# EAGLE design temp_sensors_array_A (EAGLE 7.5.0)
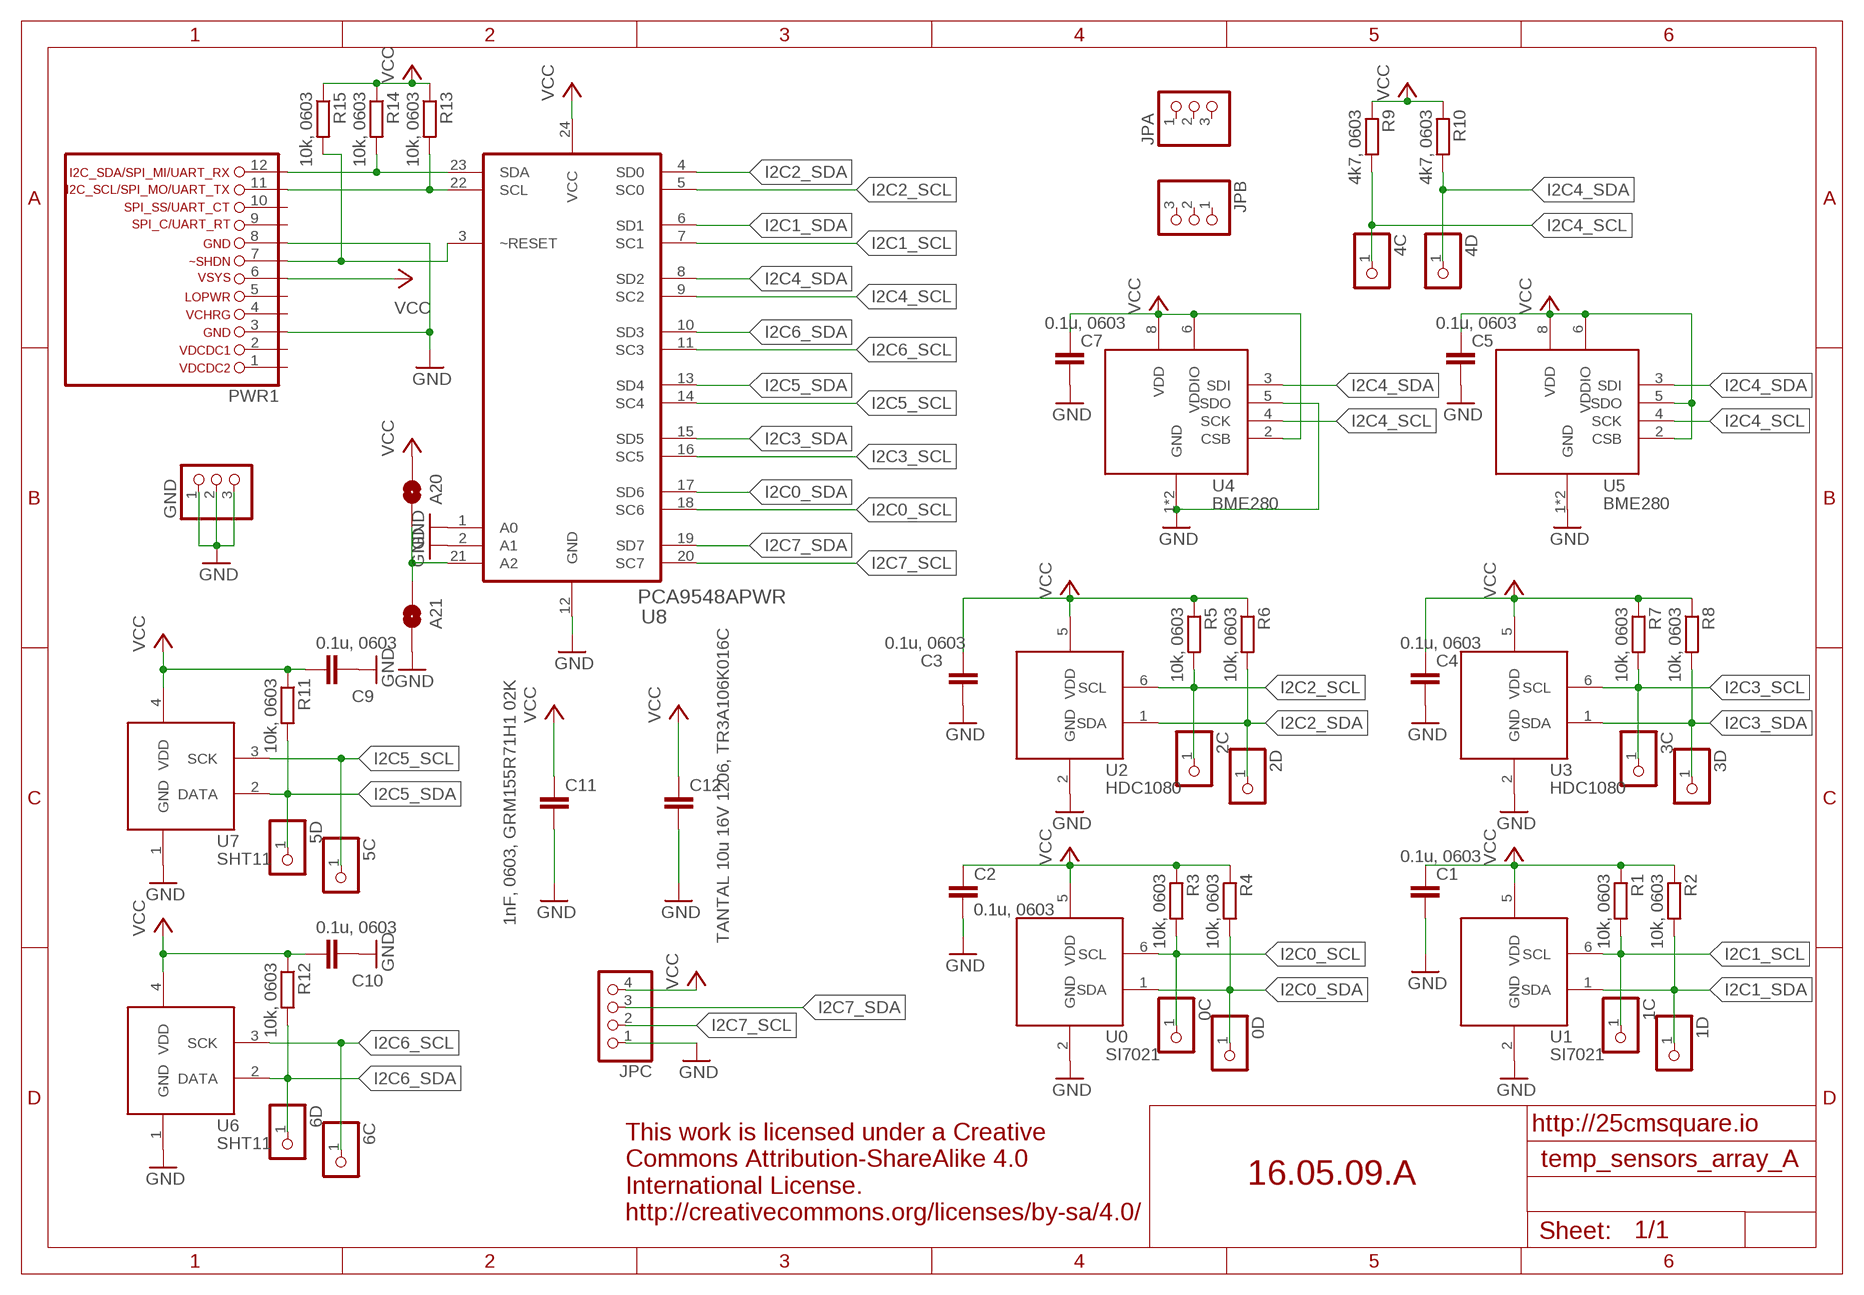
[diagram p0: schematic, sheet 1]

## Parts
0C  PINHD-1X1  [1X01]
0D  PINHD-1X1  [1X01]
1C  PINHD-1X1  [1X01]
1D  PINHD-1X1  [1X01]
2C  PINHD-1X1  [1X01]
2D  PINHD-1X1  [1X01]
3C  PINHD-1X1  [1X01]
3D  PINHD-1X1  [1X01]
4C  PINHD-1X1  [1X01]
4D  PINHD-1X1  [1X01]
5C  PINHD-1X1  [1X01]
5D  PINHD-1X1  [1X01]
6C  PINHD-1X1  [1X01]
6D  PINHD-1X1  [1X01]
A20  SOLDERJUMPERNO  [SJ_2S-NO]
A21  SOLDERJUMPERNO  [SJ_2S-NO]
C1  0.1u, 0603  C-EUC0603K  [C0603K]
C2  0.1u, 0603  C-EUC0603K  [C0603K]
C3  0.1u, 0603  C-EUC0603K  [C0603K]
C4  0.1u, 0603  C-EUC0603K  [C0603K]
C5  0.1u, 0603  C-EUC0603K  [C0603K]
C7  0.1u, 0603  C-EUC0603K  [C0603K]
C9  0.1u, 0603  C-EUC0603K  [C0603K]
C10  0.1u, 0603  C-EUC0603K  [C0603K]
C11  1nF, 0603, GRM155R71H1 02K  C-EUC0603K  [C0603K]
C12  TANTAL 10u 16V 1206, TR3A106K016C  C-EUC1206K  [C1206K]
GND  PINHD-1X3  [1X03]
JPA  PINHD-1X3  [1X03]
JPB  PINHD-1X3  [1X03]
JPC  PINHD-1X4  [1X04]
PWR1  LIWE_12_PIN_PWR  [LIWE_12_PIN]
R1  10k, 0603  R-EU_R0603  [R0603]
R2  10k, 0603  R-EU_R0603  [R0603]
R3  10k, 0603  R-EU_R0603  [R0603]
R4  10k, 0603  R-EU_R0603  [R0603]
R5  10k, 0603  R-EU_R0603  [R0603]
R6  10k, 0603  R-EU_R0603  [R0603]
R7  10k, 0603  R-EU_R0603  [R0603]
R8  10k, 0603  R-EU_R0603  [R0603]
R9  4k7, 0603  R-EU_R0603  [R0603]
R10  4k7, 0603  R-EU_R0603  [R0603]
R11  10k, 0603  R-EU_R0603  [R0603]
R12  10k, 0603  R-EU_R0603  [R0603]
R13  10k, 0603  R-EU_R0603  [R0603]
R14  10k, 0603  R-EU_R0603  [R0603]
R15  10k, 0603  R-EU_R0603  [R0603]
U0  SI7021  [SI7021]
U1  SI7021  [SI7021]
U2  HDC1080  [SI7021]
U3  HDC1080  [SI7021]
U4  BME280  [BME1080]
U5  BME280  [BME1080]
U6  SHT11  [SHT1X]
U7  SHT11  [SHT1X]
U8  PCA9548APWR  [SOP65P640X120-24N]

## Nets
GND: A21.2 C1.2 C2.2 C3.2 C4.2 C5.2 C7.2 C9.2 C10.2 C11.2 C12.2 GND.1 GND.2 GND.3 JPC.1 PWR1.3 PWR1.8 U0.2(GND) U1.2(GND) U2.2(GND) U3.2(GND) U4.1(GND) U4.5(SDO) U4.7(GND) U5.1(GND) U5.7(GND) U6.1(GND) U7.1(GND) U8.1(A0) U8.2(A1) U8.12(GND)
I2C0_SCL: 0C.1 R3.2 U0.6(SCL) U8.18(SC6)
I2C0_SDA: 0D.1 R4.2 U0.1(SDA) U8.17(SD6)
I2C1_SCL: 1C.1 R1.2 U1.6(SCL) U8.7(SC1)
I2C1_SDA: 1D.1 R2.2 U1.1(SDA) U8.6(SD1)
I2C2_SCL: 2C.1 R5.2 U2.6(SCL) U8.5(SC0)
I2C2_SDA: 2D.1 R6.2 U2.1(SDA) U8.4(SD0)
I2C3_SCL: 3C.1 R7.2 U3.6(SCL) U8.16(SC5)
I2C3_SDA: 3D.1 R8.2 U3.1(SDA) U8.15(SD5)
I2C4_SCL: 4C.1 R9.2 U4.4(SCK) U5.4(SCK) U8.9(SC2)
I2C4_SDA: 4D.1 R10.2 U4.3(SDI) U5.3(SDI) U8.8(SD2)
I2C5_SCL: 5C.1 U7.3(SCK) U8.14(SC4)
I2C5_SDA: 5D.1 R11.2 U7.2(DATA) U8.13(SD4)
I2C6_SCL: 6C.1 U6.3(SCK) U8.11(SC3)
I2C6_SDA: 6D.1 R12.2 U6.2(DATA) U8.10(SD3)
I2C7_SCL: JPC.2 U8.20(SC7)
I2C7_SDA: JPC.3 U8.19(SD7)
N$1: A20.2 A21.1 U8.21(A2)
NRESET: PWR1.7 R15.2 U8.3(~RESET)
SCL: PWR1.11 R13.2 U8.22(SCL)
SDA: PWR1.12 R14.2 U8.23(SDA)
VCC: A20.1 C1.1 C2.1 C3.1 C4.1 C5.1 C7.1 C9.1 C10.1 C11.1 C12.1 JPC.4 PWR1.6 R1.1 R2.1 R3.1 R4.1 R5.1 R6.1 R7.1 R8.1 R9.1 R10.1 R11.1 R12.1 R13.1 R14.1 R15.1 U0.5(VDD) U1.5(VDD) U2.5(VDD) U3.5(VDD) U4.2(CSB) U4.6(VDDIO) U4.8(VDD) U5.2(CSB) U5.5(SDO) U5.6(VDDIO) U5.8(VDD) U6.4(VDD) U7.4(VDD) U8.24(VCC)
Unconnected: JPA.1 JPA.2 JPA.3 JPB.1 JPB.2 JPB.3 PWR1.1 PWR1.2 PWR1.4 PWR1.5 PWR1.9 PWR1.10

## Notes on the sheet
- http://25cmsquare.io
- 16.05.09.A
- This work is licensed under a Creative
  Commons Attribution-ShareAlike 4.0
  International License.
  http://creativecommons.org/licenses/by-sa/4.0/

## Library data of the parts
0C 0D 1C 1D 2C 2D 3C 3D 4C 4D 5C 5D 6C 6D = pinhead:PINHD-1X1: PIN HEADER
A20 A21 = SparkFun-Passives:SOLDERJUMPER: Solder Jumper Standard SMD solder jumper. Used to automate production. Two varients : Normally Open and Normally Closed are the same, but have different paste layers. NC will have a large amount of paste and should jumper during reflow.
C1-C5 C7 C9-C11 = rcl:C-EU: CAPACITOR, European symbol
C12 = resistor:C-EU: CAPACITOR, European symbol; SPICEPREFIX: C
GND JPA JPB = pinhead:PINHD-1X3: PIN HEADER
JPC = pinhead:PINHD-1X4: PIN HEADER
PWR1 = 25cmsquare:LIWE_12_PIN_PWR
R1-R15 = rcl:R-EU_: RESISTOR, European symbol
U0 U1 = 25cmsquare:SI7021: SI7021 https://www.silabs.com/Support%20Documents/TechnicalDocs/Si7021-A20.pdf
U2 U3 = 25cmsquare:HDC1080: HDC1080 http://www.ti.com.cn/cn/lit/ds/symlink/hdc1080.pdf
U4 U5 = 25cmsquare:BME280
U6 U7 = 25cmsquare:SHT11: SHT11 https://www.sensirion.com/fileadmin/user_upload/customers/sensirion/Dokumente/Humidity_Sensors/Sensirion_Humidity_Sensors_SHT1x_Datasheet_V5.pdf
U8 = Texas Instruments_By_element14_Batch_1:PCA9548APWR: 8-CHANNEL I2C SWITCH WITH RESET; MPN: PCA9548APWR False; OC_FARNELL: 1607855; OC_NEWARK: 22M1602; PACKAGE: TSSOP-24; SUPPLIER: Texas Instruments

## Board
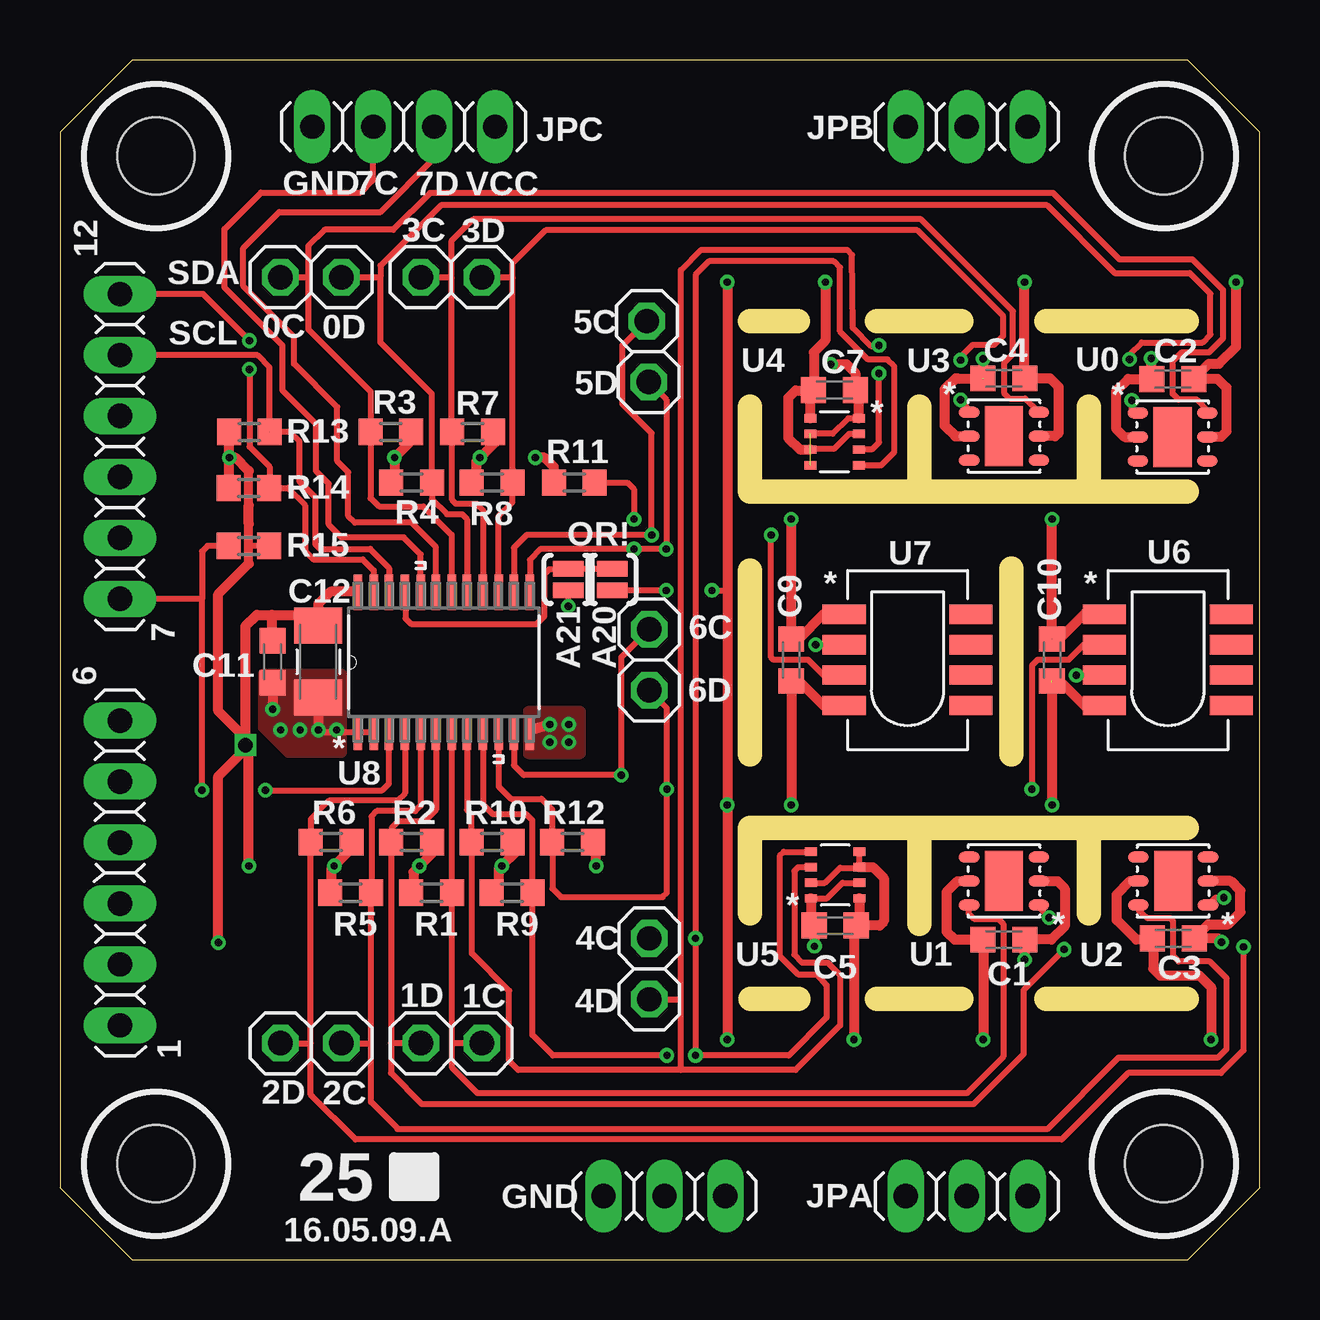
[diagram p1: board, top side]
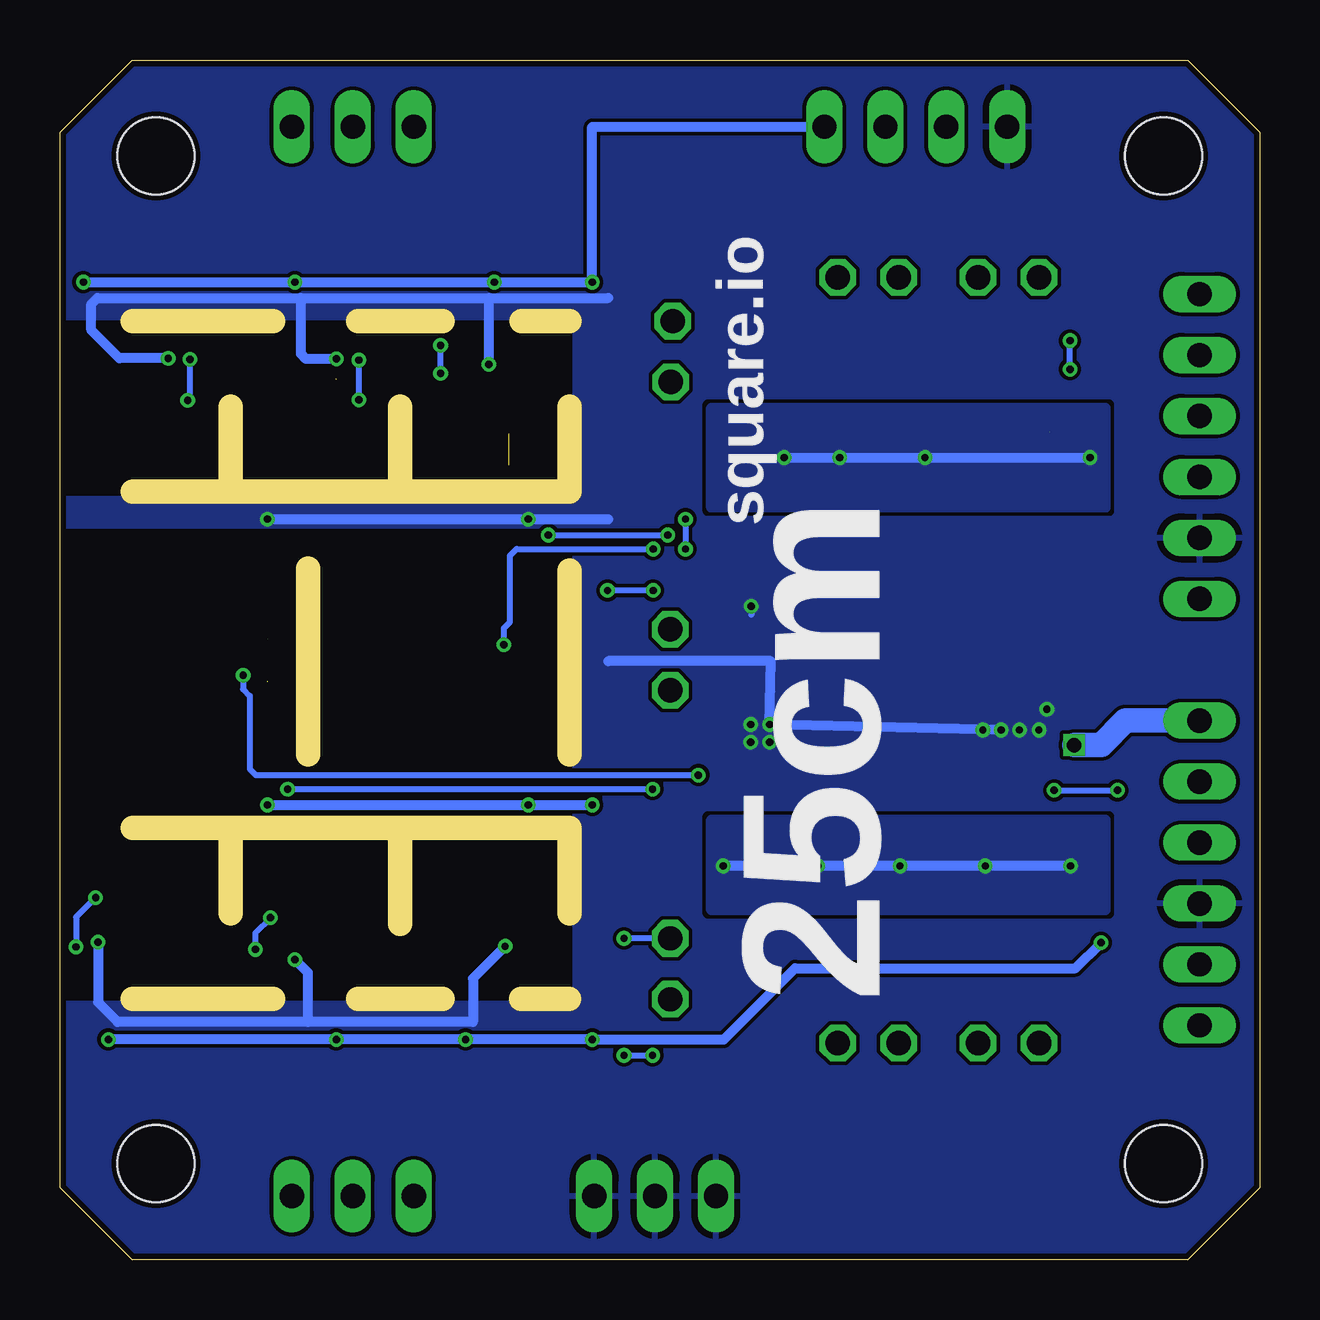
[diagram p2: board, bottom side, seen from below]

Size 50 x 50 mm. Coordinates in mm from the lower left corner, seen from the top.
Copper layers (1*16): Top 0.035mm / dielectric 1.5mm / Bottom 0.035mm
Design rules "SeeedStudio_2layer_DRU_no_angle_20140221": minimum track width 6mil, minimum drill 12mil, track to track 6mil, track to pad 6mil, pad to pad 6mil, via to via 6mil, smd to smd 0mil, copper to edge 10mil, drill to drill 10mil, minimum pad ring 10mil, minimum via ring 6mil, stop-mask expansion 2mil, vias tented up to drill 100mil, thermal gap 10mil
bRestrict: area 28.8,32 to 51.1,39; area 28.8,18 to 51.3,30.4; area 28.8,10.9 to 51.6,17.8
Milling: 20 lines

### Footprints (pad centres in the part's own frame; a part is rotated, then mirrored left to right if it is on the bottom)
1X01 = drill 1.016 octagon: 1 0,0
SJ_2S-NO = smd 0.635 x 1.27: 1 -0.45,0; 2 0.45,0
C0603K = smd 1.05 x 1.08: 1 -0.875,0; 2 0.875,0
C1206K = smd 1.5 x 2: 1 -1.5,0; 2 1.5,0
1X03 = drill 1.016 long: 1 -2.54,0; 2 0,0; 3 2.54,0
1X04 = drill 1.016 long: 1 -3.81,0; 2 -1.27,0; 3 1.27,0; 4 3.81,0
LIWE_12_PIN = drill 1.016 long: 1 22.5,15.24; 2 22.5,12.7; 3 22.5,10.16; 4 22.5,7.62; 5 22.5,5.08; 6 22.5,2.54; 7 22.5,-2.54; 8 22.5,-5.08; 9 22.5,-7.62; 10 22.5,-10.16; 11 22.5,-12.7; 12 22.5,-15.24 | hole 3.2: -21,-21; 21,-21; -21,21; 21,21
R0603 = smd 1 x 1.1: 1 -0.85,0; 2 0.85,0
SI7021 = smd 0.85 x 0.45: 1 -1.45,1; 2 -1.45,0; 3 -1.45,-1; 4 1.45,-1; 5 1.45,0; 6 1.45,1 | smd 1.6 x 2.5: P$7 0,0
BME1080 = smd 0.5 x 0.35: 1 1.012,0.975; 2 1.012,0.325; 3 1.012,-0.325; 4 1.012,-0.975; 5 -1.012,-0.975; 6 -1.012,-0.325; 7 -1.012,0.325; 8 -1.012,0.975
SHT1X = smd 1.8 x 0.8: 1 -2.64,1.905; 2 -2.64,0.635; 3 -2.64,-0.635; 4 -2.64,-1.905; 5 2.64,-1.905; 6 2.64,-0.635; 7 2.64,0.635; 8 2.64,1.905
SOP65P640X120-24N = smd 1.473 x 0.356: 1 -2.921,3.581; 2 -2.921,2.921; 3 -2.921,2.286; 4 -2.921,1.626; 5 -2.921,0.965; 6 -2.921,0.33; 7 -2.921,-0.33; 8 -2.921,-0.965; 9 -2.921,-1.626; 10 -2.921,-2.286; 11 -2.921,-2.921; 12 -2.921,-3.581; 13 2.921,-3.581; 14 2.921,-2.921; 15 2.921,-2.286; 16 2.921,-1.626; 17 2.921,-0.965; 18 2.921,-0.33; 19 2.921,0.33; 20 2.921,0.965; 21 2.921,1.626; 22 2.921,2.286; 23 2.921,2.921; 24 2.921,3.581

### Placement (x,y rotation side)
0C  9.19,40.94 0 top
0D  11.73,40.94 0 top
1C  17.58,9.02 0 top
1D  15.04,9.02 0 top
2C  11.73,9.02 0 top
2D  9.19,9.02 0 top
3C  15.04,40.94 0 top
3D  17.58,40.94 0 top
4C  24.56,13.39 0 top
4D  24.56,10.85 0 top
5C  24.46,39.12 0 top
5D  24.54,36.58 0 top
6C  24.56,26.26 0 top
6D  24.56,23.72 0 top
A20  23.01,28.35 90 top
A21  21.18,28.35 270 top
C1  39.34,13.34 0 top
C2  46.38,36.7 180 top
C3  46.41,13.39 0 top
C4  39.34,36.73 180 top
C5  32.31,13.92 180 top
C7  32.28,36.25 0 top
C9  30.48,24.99 90 top
C10  41.35,24.99 90 top
C11  8.86,24.92 270 top
C12  10.77,24.92 270 top
GND  25.2,2.64 0 top
JPA  37.8,2.64 0 top
JPB  37.8,47.22 0 top
JPC  14.33,47.22 0 top
PWR1  25,25 180 top
R1  15.49,15.29 0 top
R2  14.66,17.4 180 top
R3  13.79,34.49 180 top
R4  14.66,32.38 0 top
R5  12.12,15.29 0 top
R6  11.3,17.4 180 top
R7  17.2,34.49 180 top
R8  18.01,32.38 0 top
R9  18.85,15.29 0 top
R10  18.01,17.4 180 top
R11  21.44,32.38 0 top
R12  21.36,17.4 180 top
R13  7.9,34.49 0 top
R14  7.87,32.15 0 top
R15  7.87,29.74 180 top
U0  46.38,34.29 0 top
U1  39.34,15.77 180 top
U2  46.41,15.77 180 top
U3  39.34,34.32 0 top
U4  32.28,34.09 0 top
U5  32.31,16.03 180 top
U6  46.18,24.99 0 top
U7  35.33,24.99 0 top
U8  16,24.89 90 top

### Tracks (layer width: path | path; a pad name or v marks a point on that pad's centre or on a via)
GND  (via drill 0.3)  (4 unrouted)
  Top 0.254: 33.17,36.13 C7.2 | U4.1 32.85,35.06 32.21,34.42 U4.7 | 37.31,36.73 37.41,36.73 37.44,36.7 | U5.1 31.31,15.06 31.98,15.06 32.62,15.7 U5.7 | A21.2 v21.18,27.23 | U8.2 U8.1 10.87,21.97 v10.77,22.07
  Top 0.406: v30.48,30.86 C9.2 30.82,25.89 31.85,26.92 U7.1 | v41.35,30.86 41.35,25.86 41.71,25.91 42.75,26.95 U6.1 | 38.47,36.6 C4.2 37.41,36.73 37.34,36.73 36.88,36.27 36.88,34.75 37.31,34.31 U3.2 | 47.14,13.2 C3.2 | 47.88,15.75 U2.2 48.79,15.77 49.2,15.37 49.2,14.48 48.69,13.97 47.87,13.97 C3.2 | U5.1 31.3,14.06 C5.2 31.42,13.9 31.45,13.88 v31.45,13.06 | C11.2 v8.87,22.94 | C12.2 v10.77,22.07 | U0.2 44.37,34.29 44.02,34.65 44.02,36.2 44.53,36.7 C2.2 v45.49,37.57 | 38.48,36.7 v38.48,37.54 | U4.1 33.3,36.25 C7.2 33.15,36.26 33.15,36.96 32.79,37.31 v32.13,37.31 | v48.41,13.23 48.26,13.39 C3.2 | U1.2 41.58,15.77 41.88,15.47 41.88,13.89 41.33,13.34 C1.2 40.21,13.32 v40.21,12.5 | v20.42,22.3 19.68,22.07 arc90 U8.12
  Bottom 0.254: v21.18,27.23 21.18,26.87
  Bottom 0.406: 39.95,40.08 48.44,40.08 48.69,39.83 48.69,38.73 47.52,37.57 v45.49,37.57 | 39.95,40.08 32.13,40.08 | 32.13,40.08 27.15,40.08 | 39.67,9.91 32.79,9.91 32.79,11.71 v31.45,13.06 | 39.67,9.91 47.6,9.91 48.41,10.72 v48.41,13.23 | 27.15,30.86 v30.48,30.86 v41.35,30.86 | v10.77,22.07 v20.42,22.3 20.37,24.94 27.15,24.94 | v38.48,37.54 39.75,37.54 39.95,37.74 39.95,40.08 | 32.13,40.08 v32.13,37.31 | v40.21,12.5 39.67,11.96 39.67,9.91
  other vias: 10.01,22.07 11.53,22.07 9.19,22.07 21.21,22.3 21.21,21.56 20.42,21.56
  pour Bottom (rank 2): -2.24,50.93 -2.24,-1.78 52.15,-1.78 52.15,50.93
  pour Top (no thermals): 8.46,24.41 8.46,22.17 9.5,21.13 11.76,21.13 11.76,23.88 11.76,24.41
  pour Top (no thermals): 19.51,22.86 19.51,21.08 21.72,21.08 21.72,22.86
I2C0_SCL
  Top 0.254: U8.18 16.33,30.2 15.14,31.39 13.31,31.39 12.94,31.74 R3.2 12.95,34.51 12.95,36.17 10.35,38.77 10.35,40.97 | U0.6 47.83,35.41 47.4,35.84 46.63,35.84 46.38,36.09 46.38,37.44 46.76,37.82 47.9,37.82 48.49,38.41 48.49,40.41 47.22,41.68 44.17,41.68 41.4,44.45 15.42,44.45 13.89,42.93 11.02,42.93 10.35,42.25 10.35,40.97 | 0C.1 10.33,40.95 10.35,40.97
I2C0_SDA  (via drill 0.3)
  Top 0.254: U8.17 16.97,30.86 16.76,31.06 16.13,31.06 15.51,31.69 R4.2 15.49,32.46 15.49,36.09 13.36,38.23 13.36,40.97 | U0.1 44.68,35.41 v44.68,35.81 | 44.58,37.57 v44.58,37.52 44.58,37.72 45.09,38.23 47.62,38.23 47.95,38.56 47.95,40.26 47.09,41.12 43.97,41.12 41.15,43.94 15.88,43.94 13.36,41.43 13.36,40.97 | 0D.1 13.34,40.95 13.36,40.97
  Bottom 0.254: v44.68,35.81 44.58,35.99 v44.58,37.52
I2C1_SCL
  Top 0.254: U1.6 37.9,14.4 38.1,14.2 39.12,14.2 39.32,13.99 39.32,8.46 37.8,6.93 17.4,6.93 16.34,7.99 16.34,9.02 | U8.7 16.33,15.3 arc90 R1.2 16.34,9.02 | 1C.1 16.34,9.02
I2C1_SDA  (via drill 0.3)
  Top 0.254: U8.6 15.67,18.75 15.19,18.26 14.1,18.26 13.84,18.01 13.84,17.49 R2.2 13.79,17.34 13.79,9.02 | v41.22,14.25 40.8,14.68 U1.1 | v41.86,12.93 40.16,11.23 40.16,8.56 38.08,6.48 15.09,6.48 13.79,7.77 13.79,9.02 | 1D.1 13.79,9.02
  Bottom 0.254: v41.22,14.25 41.86,13.61 v41.86,12.93
I2C2_SCL
  Top 0.254: U8.5 15.04,18.92 14.81,18.69 13.21,18.69 12.98,18.47 12.98,15.49 R5.2 12.97,9.02 | 12.97,9.02 12.97,6.57 14.07,5.46 14.07,5.44 41.15,5.44 44.12,8.41 48.26,8.41 48.62,8.76 48.62,11.73 47.93,12.42 46.63,12.42 46.41,12.65 46.41,14.1 46.3,14.22 45.34,14.22 44.96,14.58 U2.6 | 2C.1 12.97,9.02
I2C2_SDA  (via drill 0.3)
  Top 0.254: v49.33,13.03 49.33,8.71 48.39,7.77 44.53,7.77 41.76,5 12.32,5 10.45,6.87 10.45,9.02 | U8.4 14.38,19.43 14.07,19.13 11.23,19.13 10.45,18.35 R6.2 10.45,9.02 | U2.1 48.17,15.09 v48.51,15.09 | 2D.1 10.45,9.02
  Bottom 0.254: v48.51,15.09 49.33,14.28 v49.33,13.03
I2C3_SCL
  Top 0.254: U8.16 17.65,27.84 17.65,31.22 17.37,31.5 16.51,31.5 16.35,31.66 R7.2 16.33,34.69 16.33,40.92 | 16.33,40.92 16.33,42.47 17.22,43.36 35.89,43.36 39.73,39.52 39.73,37.74 39.34,37.36 39.34,36.12 39.57,35.89 40.22,35.89 U3.6 | 3C.1 16.31,40.95 16.33,40.92
I2C3_SDA  (via drill 0.3)
  Top 0.254: 37.92,35.34 U3.1 37.9,35.41 v37.54,35.84 | U8.15 18.29,30.99 18.86,31.56 R8.2 18.87,32.93 18.87,40.92 | 18.87,40.92 18.87,41.53 20.24,42.9 35.74,42.9 39.32,39.32 39.32,38.51 38.94,38.12 38.05,38.12 37.54,37.62 v37.54,37.49 | 3D.1 18.85,40.95 18.87,40.92
  Bottom 0.254: v37.54,35.84 v37.54,37.49
I2C4_SCL  (via drill 0.3)
  Top 0.254: U8.9 17.63,18.97 18.03,18.57 19.43,18.57 19.68,18.31 19.68,15.4 R9.2 19.7,9.36 20.55,8.51 v25.3,8.51 | U4.4 34.23,33.11 34.77,33.66 34.77,37.24 34.49,37.52 33.68,37.52 32.51,38.68 32.51,41.35 32.26,41.6 27.05,41.6 26.49,41.05 v26.49,13.39 v26.49,8.51 30.38,8.51 31.95,10.08 31.95,11.43 31.55,11.89 30.76,11.89 30,12.65 30,16.82 30.18,16.99 31.29,16.99 U5.4
  Bottom 0.254: v26.49,8.51 v25.3,8.51 | 4C.1 v26.49,13.39
I2C4_SDA  (via drill 0.3 pad 0.3)
  Top 0.254: U5.3 30.77,16.35 30.61,16.2 30.61,12.7 30.94,12.37 32,12.37 32.51,11.86 32.51,9.75 30.66,7.9 25.88,7.9 | 25.88,7.9 25.88,10.85 | 25.88,10.85 25.88,41.25 26.72,42.09 32.82,42.09 33.02,41.88 33.05,38.84 33.81,38.08 34.11,38.08 v34.14,38.1 | U8.8 16.97,18.75 17.14,18.57 17.14,17.51 R10.2 17.17,16.84 17.17,12.75 18.72,11.2 18.72,8.28 19.1,7.9 25.88,7.9 | v34.14,36.93 34.14,34.06 33.84,33.76 U4.3 | 4D.1 25.88,10.85
  Bottom 0.254: v34.14,36.93 v34.14,38.1
I2C5_SCL  (via drill 0.3)
  Top 0.254: U8.14 18.92,29.67 19.46,30.2 v24.66,30.2 24.66,34.44 23.44,35.66 23.44,38.1 5C.1 | U7.3 31.83,24.36 31.19,24.99 29.74,24.99 29.64,25.09 v29.64,30.2
  Bottom 0.254: v29.64,30.2 v24.66,30.2
I2C5_SDA  (via drill 0.3)
  Top 0.254: U7.2 v31.5,25.63 | U8.13 19.58,29.16 20.04,29.62 23.42,29.62 v23.93,29.62 v25.27,29.62 25.27,35.84 5D.1 | R11.2 23.65,32.38 23.93,32.11 v23.93,30.86
  Bottom 0.254: v25.27,29.62 30.96,29.62 31.24,29.34 31.24,26.57 31.5,26.31 v31.5,25.63 | v23.93,30.86 v23.93,29.62
I2C6_SCL  (via drill 0.3)
  Top 0.254: U8.11 18.92,20.6 19.33,20.19 v23.39,20.19 23.39,25.09 6C.1 | U6.3 v42.37,24.36
  Bottom 0.254: v23.39,20.19 41.83,20.19 42.09,20.45 42.09,23.5 42.37,23.77 v42.37,24.36
I2C6_SDA  (via drill 0.3)
  Top 0.254: v40.51,19.61 40.51,24.77 40.74,24.99 42.04,24.99 42.67,25.63 U6.2 | U8.10 18.29,19.71 18.8,19.2 20.07,19.2 20.51,18.76 R12.2 20.52,17.4 20.52,15.47 20.88,15.11 25.12,15.11 25.3,15.29 v25.3,19.61 25.3,22.99 6D.1
  Bottom 0.254: v40.51,19.61 25.48,19.61 v25.3,19.61
I2C7_SCL
  Top 0.254: U8.20 15.04,29.39 14.33,30.1 11.73,30.1 11.2,30.63 11.2,32.33 10.67,32.87 10.67,34.82 9.27,36.22 9.27,38.1 6.86,40.51 6.86,42.95 8.38,44.48 12.52,44.48 13.06,45.01 JPC.2
I2C7_SDA
  Top 0.254: U8.19 15.67,29.69 14.66,30.71 12.29,30.71 12.01,30.99 12.01,32.82 11.56,33.27 11.56,35.53 9.75,37.34 9.75,38.46 7.64,40.56 7.64,42.16 9.14,43.66 13.36,43.66 15.6,45.9 JPC.3
N$1
  Top 0.254: U8.21 14.4,27.81 14.4,26.72 14.63,26.49 19.86,26.49 20.19,26.82 20.19,28.57 20.4,28.78 21.16,28.78 A21.1 A20.2
NRESET  (via drill 0.3)
  Top 0.254: v8.56,19.56 13.44,19.56 13.72,19.84 U8.3 | v5.92,19.56 5.92,27.53 | 5.92,27.53 PWR1.7 | R15.2 6.15,29.74 5.92,29.52 5.92,27.53
  Bottom 0.254: v8.56,19.56 v5.92,19.56
SCL  (1 unrouted)
  Top 0.254: 8.74,34.49 8.74,37.19 8.23,37.69 8.22,37.69 PWR1.11 | U8.22 13.72,28.83 12.93,29.62 10.85,29.62 10.64,29.82 10.64,31.77 9.98,32.44 9.98,34.11 9.6,34.49 R13.2
SDA  (via drill 0.3)
  Top 0.254: U8.23 13.08,28.73 12.62,29.18 10.57,29.18 10.21,29.54 10.21,31.45 9.5,32.16 R14.2 8.74,32.17 8.74,33.05 7.9,33.88 v7.9,37.11 | 2.48,40.26 PWR1.12 5.96,40.24 v7.9,38.3
  Bottom 0.254: v7.9,37.11 v7.9,38.3
VCC  (via drill 0.3, 0.6)  (1 unrouted)
  Top 0.254: R6.1 11.97,16.95 | 11.3,15.38 R5.1 | 14.73,15.46 R1.1 | 18.29,15.51 R9.1 | R10.1 18.96,16.95 | 22.35,17.36 R12.1 | R2.1 15.51,16.93 | R8.1 17.37,32.5 | 18.2,34.12 R7.1 | 13.95,32.4 R4.1 | 14.07,33.43 v13.95,33.43 | 41.3,36.7 40.31,36.7 40.21,36.8 | U4.2 32.89,34.41 32.26,33.78 31.29,33.78 U4.6 | 44.6,15.77 44.09,15.27 44.09,14.12 44.91,13.31 45.52,13.31 | 36.96,13.69 37.31,13.34 38.48,13.34 | U5.2 31.88,15.7 32.51,16.33 33.3,16.33 U5.6 U5.5 | 14.64,34.12 R3.1 | R15.1 7.92,29.74 7.87,29.69 | A20.1 v25.27,27.9 v25.27,27.89 | v27.18,27.89 27.76,27.89 27.81,27.94
  Top 0.381: 7.87,29.01 7.87,29.69 7.87,30.66 | 7.87,31.45 7.87,32.87
  Top 0.406: C2.1 47.47,36.68 | v27.81,40.74 27.81,27.94 v27.81,18.95 v27.81,9.17 | v30.48,18.95 C9.1 30.8,24.12 31.83,23.09 U7.4 | v41.35,18.95 41.35,24.08 41.78,24 42.77,23.01 U6.4 | 33.2,13.9 C5.1 | C5.1 33.32,14.06 U5.8 33.34,15.04 33.33,15.04 | 11.3,15.38 11.3,16.28 v11.43,16.41 11.97,16.95 | 14.73,15.46 14.73,16.15 v14.99,16.41 15.51,16.93 | 18.29,15.51 18.29,16.28 v18.41,16.41 18.96,16.95 | v22.35,16.41 22.35,17.36 | 17.37,32.5 17.37,33.3 v17.5,33.43 18.2,34.12 | v19.81,33.43 20.19,33.43 20.57,33.05 20.57,32.4 R11.1 | 13.95,32.4 v13.95,33.43 14.64,34.12 | v7.87,16.41 7.87,21.41 | 7.87,21.41 7.87,21.59 | 7.87,21.59 v7.73,21.44 7.73,26.4 8.2,26.87 8.84,26.87 | v6.6,13.21 6.6,20.14 7.87,21.41 | C2.1 48.26,36.7 48.62,36.35 48.62,34.52 48.39,34.29 U0.5 | U3.5 41.48,34.31 41.63,34.47 41.63,36.37 41.3,36.7 41.27,36.73 C4.1 40.21,36.73 40.21,36.8 v40.21,40.74 | v49.02,40.74 49.02,38.05 48.31,37.34 47.89,37.34 C2.1 | C7.1 31.41,36.44 | C7.1 31.38,36.22 30.66,36.22 30.35,35.92 30.35,34.24 30.84,33.76 U4.6 | U4.8 31.27,36.11 C7.1 | v31.9,40.74 31.9,38.3 31.42,37.82 C7.1 | U2.5 44.6,15.77 44.04,15.21 44.04,14.15 44.86,13.34 C3.1 | 45.52,13.31 45.57,13.26 45.57,12.12 45.85,11.84 47.5,11.84 47.98,11.35 v47.98,9.17 | C1.1 37.29,13.34 36.96,13.66 36.96,13.69 36.96,15.32 37.41,15.77 U1.5 | 38.48,13.34 v38.48,9.17 | U5.6 33.88,16.36 34.34,15.9 34.34,14.1 34.16,13.92 33.2,13.92 | 33.2,13.92 C5.1 | 33.2,13.92 33.1,13.82 v33.1,9.17 | 7.87,21.59 6.6,22.86 6.6,27.74 7.87,29.01 | 7.87,30.66 7.87,31.45 | U8.24 12.39,27.84 11.28,27.84 10.77,27.33 C12.1 10.39,26.42 9.93,26.87 8.84,26.87 | 7.87,32.87 7.32,33.43 v7.06,33.43
  Top 0.406: R14.1 7.06,32.19 v7.06,33.43 | v7.06,33.43 v7.05,33.44 R13.1 | C11.1 8.84,25.82 8.84,26.87
  Bottom 0.254: v25.27,27.89 v27.18,27.89
  Bottom 0.406: v49.02,40.74 v40.21,40.74 v31.9,40.74 v27.81,40.74 27.81,47.22 JPC.4 | v47.98,9.17 v38.48,9.17 v33.1,9.17 v27.81,9.17 22.33,9.17 19.36,12.14 7.67,12.14 v6.6,13.21 | v41.35,18.95 v30.48,18.95 v27.81,18.95 | v22.35,16.41 v18.41,16.41 v14.99,16.41 v11.43,16.41 v7.87,16.41 | v19.81,33.43 v17.5,33.43 v13.95,33.43 v7.06,33.43
  Bottom 1.016: v7.73,21.44 6.6,21.44 5.59,22.46 PWR1.6
  pour Bottom: 6.43,35.51 6.43,31.34 22.86,31.34 22.86,35.51
  pour Bottom: 6.43,18.34 6.43,14.55 22.86,14.55 22.86,18.34

### Text on the board
tNames: GND | 7C | 7D | VCC | 12 | SDA | SCL | OR! | 7 | 6 | * | 1 | 25 | 16.05.09.A
bNames: square.io | 25cm